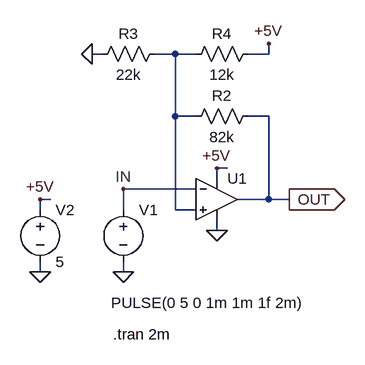
[diagram p0: schematic hys_comparetor_inv.asc]
hys_comparetor_inv.asc, the LTspice schematic file:
Version 4
SHEET 1 880 680
WIRE 32 -48 16 -48
WIRE 144 -48 112 -48
WIRE 176 -48 144 -48
WIRE 288 -48 288 -64
WIRE 288 -48 256 -48
WIRE 144 48 144 -48
WIRE 176 48 144 48
WIRE 288 48 256 48
WIRE 224 128 208 128
WIRE 208 144 208 128
WIRE 176 160 64 160
WIRE -48 176 -64 176
WIRE 288 176 288 48
WIRE 288 176 240 176
WIRE 320 176 288 176
WIRE -64 192 -64 176
WIRE 64 192 64 160
WIRE 144 192 144 48
WIRE 176 192 144 192
WIRE 208 224 208 208
WIRE -64 288 -64 272
WIRE 64 288 64 272
FLAG 208 128 +5V
FLAG 208 224 0
FLAG 320 176 OUT
IOPIN 320 176 Out
FLAG 64 288 0
FLAG -64 288 0
FLAG -64 176 +5V
FLAG 16 -48 0
FLAG 288 -64 +5V
FLAG 64 160 IN
SYMBOL Opamps\\UniversalOpamp2 208 176 R0
SYMATTR InstName U1
SYMBOL res 272 32 R90
WINDOW 0 0 56 VBottom 2
WINDOW 3 32 56 VTop 2
SYMATTR InstName R2
SYMATTR Value 82k
SYMBOL voltage 64 176 R0
WINDOW 3 -19 159 Left 2
WINDOW 123 0 0 Left 0
WINDOW 39 0 0 Left 0
SYMATTR Value PULSE(0 5 0 1m 1m 1f 2m)
SYMATTR InstName V1
SYMBOL voltage -64 176 R0
WINDOW 123 0 0 Left 0
WINDOW 39 0 0 Left 0
SYMATTR InstName V2
SYMATTR Value 5
SYMBOL res 128 -64 R90
WINDOW 0 0 56 VBottom 2
WINDOW 3 32 56 VTop 2
SYMATTR InstName R3
SYMATTR Value 22k
SYMBOL res 272 -64 R90
WINDOW 0 0 56 VBottom 2
WINDOW 3 32 56 VTop 2
SYMATTR InstName R4
SYMATTR Value 12k
TEXT 48 384 Left 2 !.tran 2m

The netlist it stands for:
* hys_comparetor_inv.asc
XU1 N001 IN +5V 0 OUT level.2 Avol=1Meg GBW=10Meg Slew=10Meg ilimit=25m rail=0 Vos=0 phimargin=45 en=0 enk=0 in=0 ink=0 Rin=500Meg  ; pins IN+ IN- V+ V- OUT
R2 OUT N001 82k
V1 IN 0 PULSE(0 5 0 1m 1m 1f 2m)
V2 +5V 0 5
R3 N001 0 22k
R4 +5V N001 12k
.tran 2m
.lib UniversalOpamps2.sub
.backanno
.end